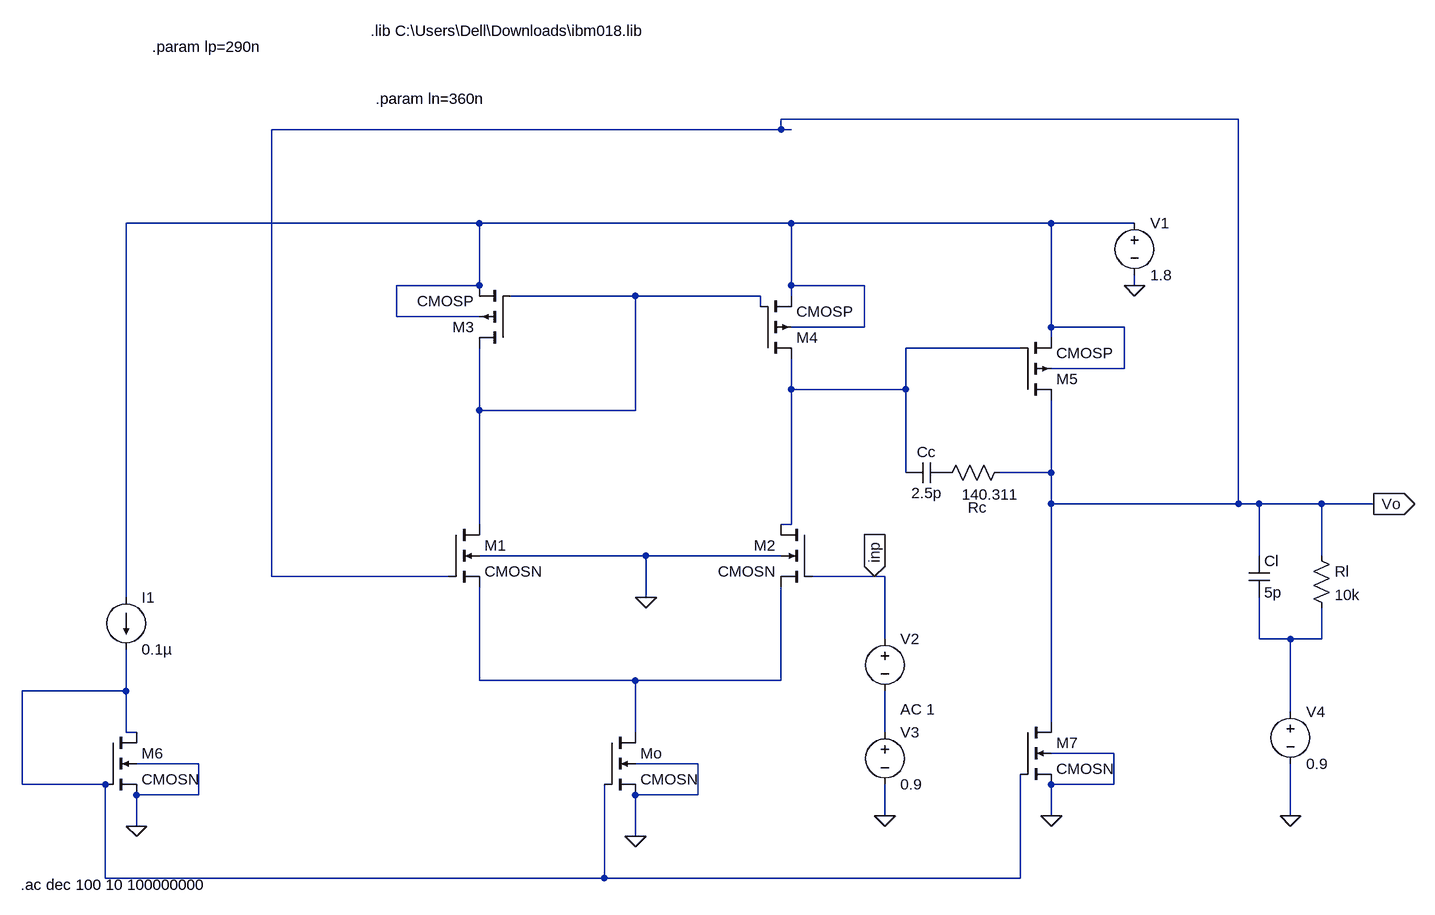
[diagram p0: schematic design project #1.asc]
design project #1.asc, the LTspice schematic file:
Version 4
SHEET 1 1732 720
WIRE 1216 -496 512 -496
WIRE 512 -480 512 -496
WIRE 512 -480 -272 -480
WIRE 528 -480 512 -480
WIRE 48 -336 -496 -336
WIRE 528 -336 48 -336
WIRE 928 -336 528 -336
WIRE 1056 -336 928 -336
WIRE 48 -240 48 -336
WIRE 48 -240 -80 -240
WIRE 528 -240 528 -336
WIRE 640 -240 528 -240
WIRE 1056 -240 1056 -256
WIRE 288 -224 96 -224
WIRE 480 -224 288 -224
WIRE 528 -224 528 -240
WIRE 480 -208 480 -224
WIRE -80 -192 -80 -240
WIRE 48 -192 -80 -192
WIRE 640 -176 640 -240
WIRE 640 -176 528 -176
WIRE 928 -176 928 -336
WIRE 1040 -176 928 -176
WIRE 928 -160 928 -176
WIRE 880 -144 704 -144
WIRE 1040 -112 1040 -176
WIRE 1040 -112 928 -112
WIRE 528 -80 528 -128
WIRE 704 -80 704 -144
WIRE 704 -80 528 -80
WIRE 48 -48 48 -144
WIRE 288 -48 288 -224
WIRE 288 -48 48 -48
WIRE 704 48 704 -80
WIRE 928 48 928 -64
WIRE 928 48 848 48
WIRE 928 96 928 48
WIRE 1216 96 1216 -496
WIRE 1216 96 928 96
WIRE 1248 96 1216 96
WIRE 1344 96 1248 96
WIRE 1424 96 1344 96
WIRE 48 128 48 -48
WIRE 528 128 528 -80
WIRE 528 128 512 128
WIRE 304 176 48 176
WIRE 512 176 304 176
WIRE 1248 176 1248 96
WIRE 1344 176 1344 96
WIRE -272 208 -272 -480
WIRE 0 208 -272 208
WIRE 656 208 560 208
WIRE 672 208 656 208
WIRE -496 240 -496 -336
WIRE 304 240 304 176
WIRE 672 304 672 208
WIRE 1248 304 1248 240
WIRE 1296 304 1248 304
WIRE 1344 304 1344 256
WIRE 1344 304 1296 304
WIRE 48 368 48 224
WIRE 288 368 48 368
WIRE 512 368 512 224
WIRE 512 368 288 368
WIRE -496 384 -496 320
WIRE -496 384 -656 384
WIRE 1296 416 1296 304
WIRE 928 432 928 96
WIRE -496 448 -496 384
WIRE -480 448 -496 448
WIRE 288 448 288 368
WIRE 672 448 672 384
WIRE 1024 480 928 480
WIRE -384 496 -480 496
WIRE 384 496 288 496
WIRE -656 528 -656 384
WIRE -528 528 -656 528
WIRE 1024 528 1024 480
WIRE 1024 528 928 528
WIRE -384 544 -384 496
WIRE -384 544 -480 544
WIRE 384 544 384 496
WIRE 384 544 288 544
WIRE 672 576 672 528
WIRE 928 576 928 528
WIRE 1296 576 1296 496
WIRE -480 592 -480 544
WIRE 288 608 288 544
WIRE -528 672 -528 528
WIRE 240 672 240 528
WIRE 240 672 -528 672
WIRE 880 672 880 512
WIRE 880 672 240 672
FLAG 928 576 0
FLAG -480 592 0
FLAG 288 608 0
FLAG 1296 576 0
FLAG 1056 -240 0
FLAG 1424 96 Vo
IOPIN 1424 96 Out
FLAG 304 240 0
FLAG 672 576 0
FLAG 656 208 inp
IOPIN 656 208 In
SYMBOL nmos4 0 128 R0
SYMATTR InstName M1
SYMATTR Value CMOSN
SYMATTR Value2 l=ln w=11.8197u
SYMBOL nmos4 560 128 M0
SYMATTR InstName M2
SYMATTR Value CMOSN
SYMATTR Value2 l=ln w=11.8197u
SYMBOL pmos4 96 -144 R180
SYMATTR InstName M3
SYMATTR Value CMOSP
SYMATTR Value2 l=lp w=5.4169u
SYMBOL pmos4 480 -128 M180
SYMATTR InstName M4
SYMATTR Value CMOSP
SYMATTR Value2 l=lp w=5.4169u
SYMBOL nmos4 240 448 R0
SYMATTR InstName Mo
SYMATTR Value CMOSN
SYMATTR Value2 l=2200n w=180.7854u
SYMBOL pmos4 880 -64 M180
SYMATTR InstName M5
SYMATTR Value CMOSP
SYMATTR Value2 l=lp w=132.4215u
SYMBOL current -496 240 R0
WINDOW 123 0 0 Left 0
WINDOW 39 0 0 Left 0
SYMATTR InstName I1
SYMATTR Value 0.1µ
SYMBOL nmos4 -528 448 R0
SYMATTR InstName M6
SYMATTR Value CMOSN
SYMATTR Value2 l=2200n w=0.24u
SYMBOL nmos4 880 432 R0
SYMATTR InstName M7
SYMATTR Value CMOSN
SYMATTR Value2 l=2200n w=2209.70499u
SYMBOL voltage 1056 -352 R0
WINDOW 123 0 0 Left 0
WINDOW 39 0 0 Left 0
SYMATTR InstName V1
SYMATTR Value 1.8
SYMBOL cap 768 32 R90
WINDOW 0 0 32 VBottom 2
WINDOW 3 32 32 VTop 2
SYMATTR InstName Cc
SYMATTR Value 2.5p
SYMBOL res 864 32 R90
WINDOW 0 85 50 VBottom 2
WINDOW 3 34 30 VTop 2
SYMATTR InstName Rc
SYMATTR Value 140.311
SYMATTR SpiceLine tol=1 pwr=0.1
SYMBOL cap 1232 176 R0
SYMATTR InstName Cl
SYMATTR Value 5p
SYMBOL res 1328 160 R0
SYMATTR InstName Rl
SYMATTR Value 10k
SYMBOL voltage 1296 400 R0
WINDOW 123 0 0 Left 0
WINDOW 39 0 0 Left 0
SYMATTR InstName V4
SYMATTR Value 0.9
SYMBOL voltage 672 288 R0
WINDOW 123 24 124 Left 2
WINDOW 39 0 0 Left 0
SYMATTR InstName V2
SYMATTR Value ""
SYMATTR Value2 AC 1
SYMBOL voltage 672 432 R0
WINDOW 123 0 0 Left 0
WINDOW 39 0 0 Left 0
SYMATTR InstName V3
SYMATTR Value 0.9
TEXT -120 -632 Left 2 !.lib C:\\Users\\Dell\\Downloads\\ibm018.lib
TEXT -112 -528 Left 2 !.param ln=360n
TEXT -456 -608 Left 2 !.param lp=290n
TEXT -658 682 Left 2 !.ac dec 100 10 100000000

The netlist it stands for:
* design project #1.asc
M1 N002 Vo N005 0 CMOSN l=ln w=11.8197u
M2 N003 inp N005 0 CMOSN l=ln w=11.8197u
M3 N002 N002 N001 N001 CMOSP l=lp w=5.4169u
M4 N003 N002 N001 N001 CMOSP l=lp w=5.4169u
Mo N005 N006 0 0 CMOSN l=2200n w=180.7854u
M5 Vo N003 N001 N001 CMOSP l=lp w=132.4215u
I1 N001 N006 0.1µ
M6 N006 N006 0 0 CMOSN l=2200n w=0.24u
M7 Vo N006 0 0 CMOSN l=2200n w=2209.70499u
V1 N001 0 1.8
Cc P001 N003 2.5p
Rc Vo P001 140.311 tol=1 pwr=0.1
Cl Vo N004 5p
Rl Vo N004 10k
V4 N004 0 0.9
V2 inp N007 AC 1
V3 N007 0 0.9
.model NMOS NMOS
.model PMOS PMOS
.lib standard.mos
.lib C:\Users\Dell\Downloads\ibm018.lib
.param ln=360n
.param lp=290n
.ac dec 100 10 100000000
.backanno
.end